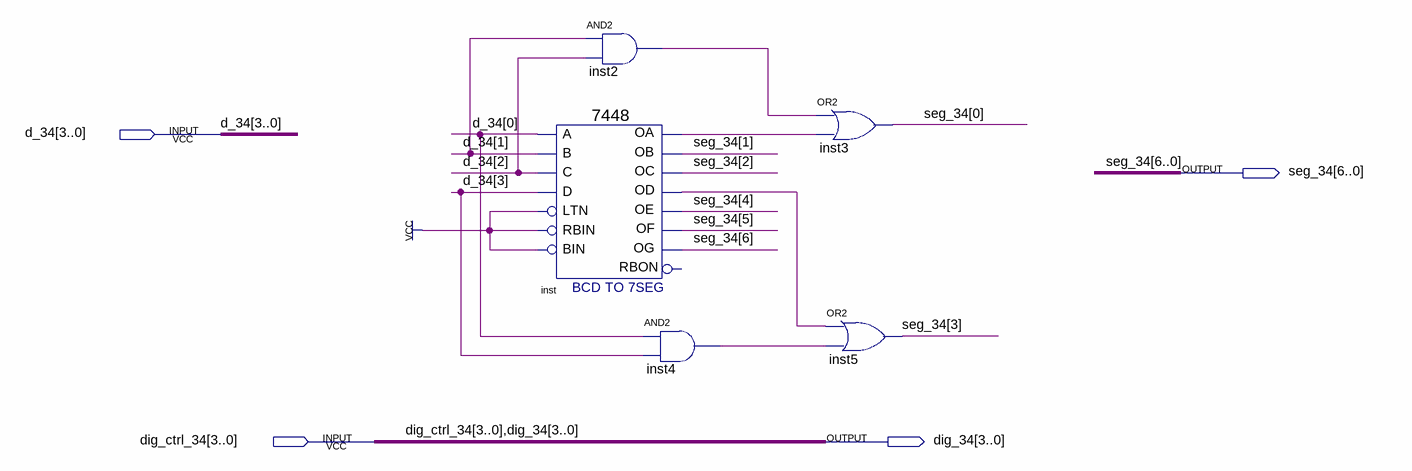
[diagram p0: schematic sheet]
// Quartus schematic tz_34.bdf as structural Verilog: 5 symbols, 4 pins
module tz_34 (
  input  [3:0] d_34,
  input  [3:0] dig_ctrl_34,
  output [6:0] seg_34,
  output [3:0] dig_34
);

  wire inst2_out, inst4_out, inst_oa, inst_od;

  \7448  inst (
    .A(d_34[0]), .C(d_34[2]), .D(d_34[3]), .B(d_34[1]), .RBIN(1'b1), .BIN(1'b1), .LTN(1'b1), .OC(seg_34[2]),
    .OE(seg_34[4]), .OD(inst_od), .OF(seg_34[5]), .OG(seg_34[6]), .OB(seg_34[1]), .OA(inst_oa));  // open: RBON
  and inst2 (inst2_out, d_34[1], d_34[2]);
  and inst4 (inst4_out, d_34[0], d_34[3]);
  or inst3 (seg_34[0], inst2_out, inst_oa);
  or inst5 (seg_34[3], inst_od, inst4_out);
endmodule
